# EAGLE design untitled (EAGLE 5.06)
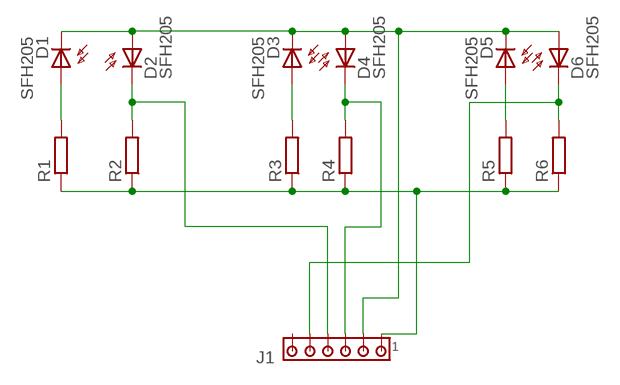
[diagram p0: schematic, sheet 1]

## Parts
D1  SFH205  [SFH205]
D2  SFH205  [SFH205]
D3  SFH205  [SFH205]
D4  SFH205  [SFH205]
D5  SFH205  [SFH205]
D6  SFH205  [SFH205]
J1  MTA06-100  [10X06MTA]
R1  R-EU_0207/10  [0207/10]
R2  R-EU_0207/10  [0207/10]
R3  R-EU_0207/10  [0207/10]
R4  R-EU_0207/10  [0207/10]
R5  R-EU_0207/10  [0207/10]
R6  R-EU_0207/10  [0207/10]

## Nets
N$1: D1.A R1.2
N$3: D3.A R3.2
N$4: D4.K(C) J1.4 R4.2
N$5: D5.A R5.2
N$6: D6.K(C) J1.2 R6.2
N$7: J1.6 R1.1 R2.1 R3.1 R4.1 R5.1 R6.1
N$8: D1.K(C) D2.A D3.K(C) D4.A D5.K(C) D6.A J1.5
N$11: D2.K(C) J1.3 R2.2
Unconnected: J1.1

## Library data of the parts
D1-D6 = opto-trans-siemens:SFH205: PHOTO DIODE
J1 = con-amp:MTA06-100: AMP connector
R1-R6 = rcl:R-EU_: RESISTOR, European symbol

## Board
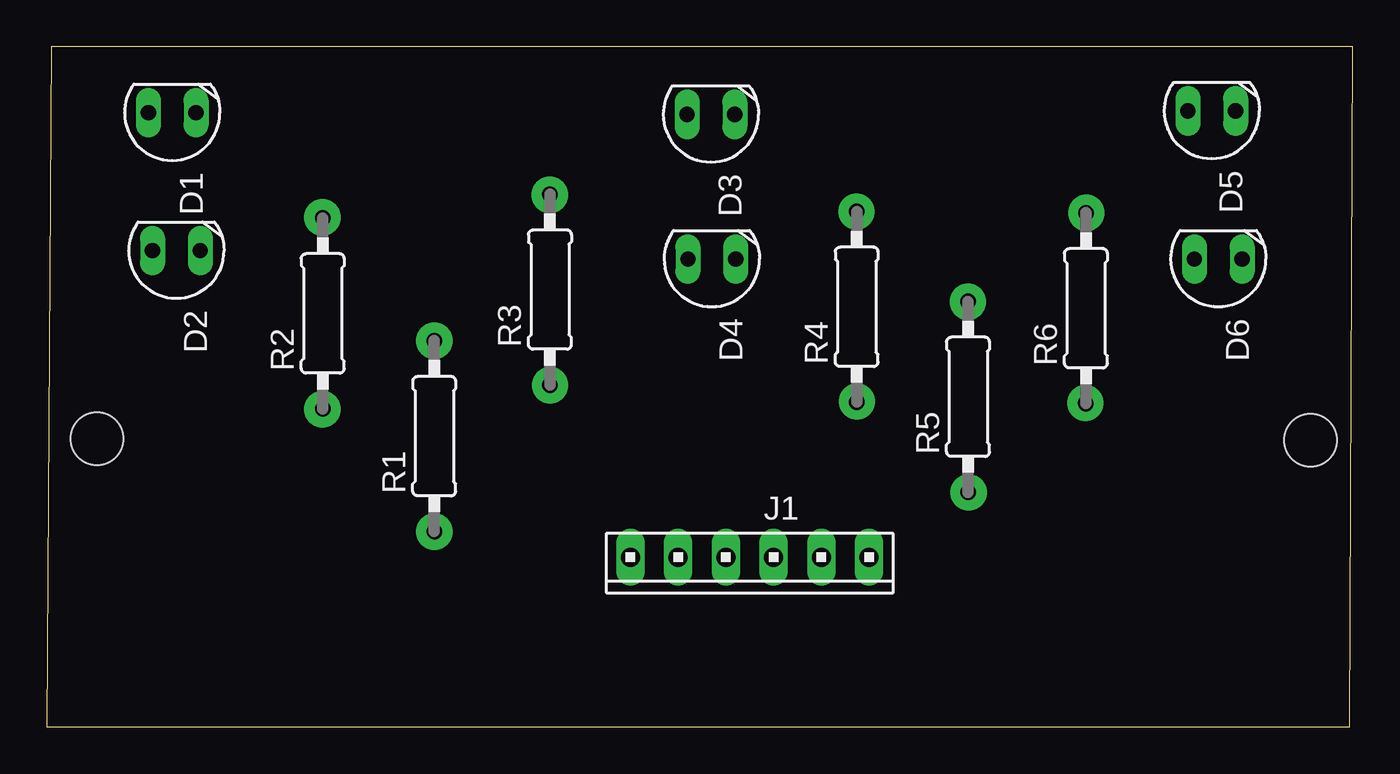
[diagram p1: board, top side]
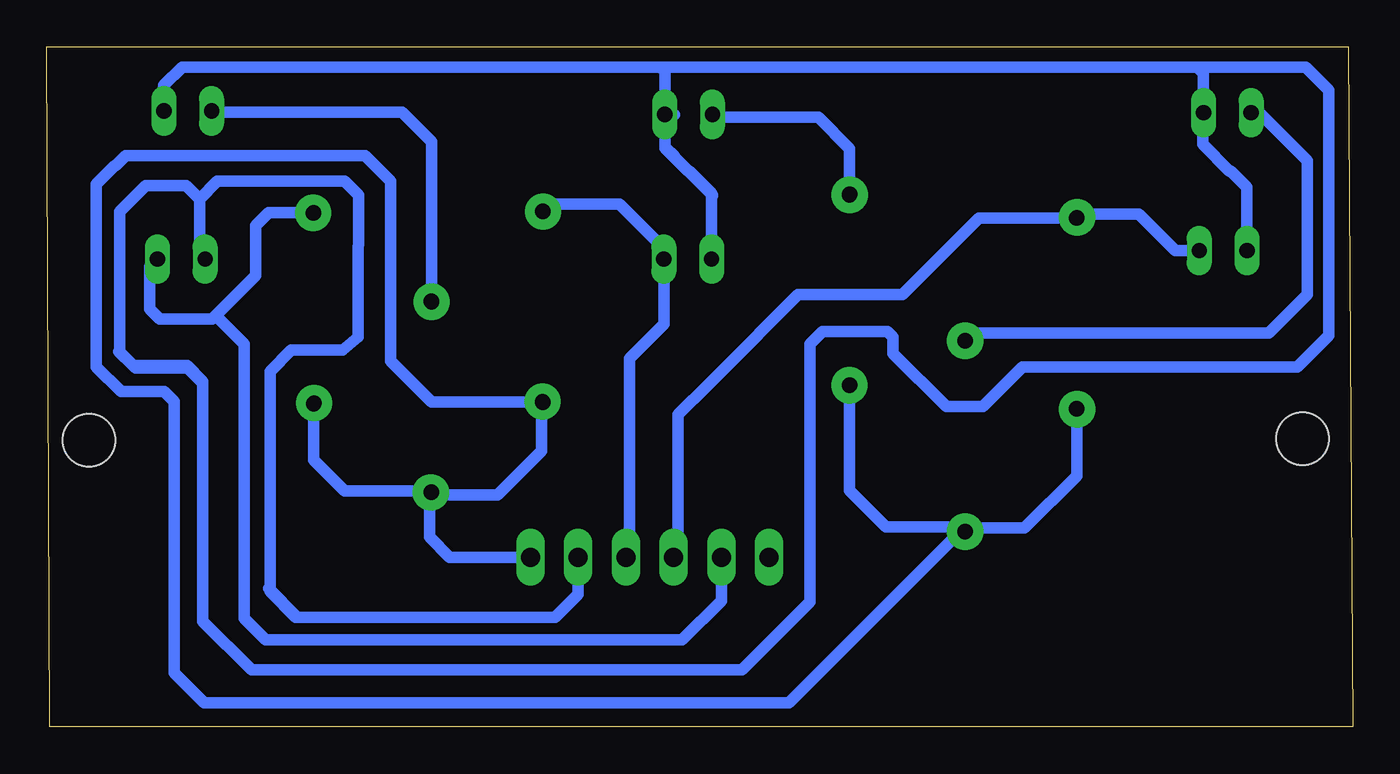
[diagram p2: board, bottom side, seen from below]

Size 69.51 x 36.2 mm. Coordinates in mm from the lower left corner, seen from the top.
Outline: 0,0 69.36,0 69.51,36.2 0.23,36.2 0,0
Copper layers (1*16): Top 0.035mm / dielectric 1.5mm / Bottom 0.035mm
Design rules "default": minimum track width 10mil, minimum drill 24mil, track to track 8mil, track to pad 8mil, pad to pad 8mil, via to via 8mil, smd to smd 8mil, copper to edge 40mil, drill to drill 8mil, minimum pad ring 10mil, minimum via ring 8mil, stop-mask expansion 4mil, vias tented up to drill 0mil, thermal gap 10mil
Holes 2.8 mm at 2.66,15.35 67.28,15.27

### Footprints (pad centres in the part's own frame; a part is rotated, then mirrored left to right if it is on the bottom)
SFH205 = drill 0.813 long: A 0,-1.27; K 0,1.27
10X06MTA = drill 1.016 long: 1 6.35,0; 2 3.81,0; 3 1.27,0; 4 -1.27,0; 5 -3.81,0; 6 -6.35,0
0207/10 = drill 0.813 octagon: 1 -5.08,0; 2 5.08,0

### Placement (x,y rotation side)
D1  6.67,32.7 270 top
D2  6.89,25.36 270 top
D3  35.35,32.61 270 top
D4  35.39,24.91 270 top
D5  62.01,32.8 270 top
D6  62.36,24.91 270 top
J1  37.41,9.03 180 top
R1  20.62,15.48 90 top
R2  14.68,22.01 90 top
R3  26.78,23.28 90 top
R4  43.11,22.37 90 top
R5  49.04,17.57 90 top
R6  55.31,22.29 90 top

### Tracks (layer width: path | path; a pad name or v marks a point on that pad's centre or on a via)
N$1
  Bottom 0.61: D1.A 4.98,32.7 2.42,30.14 2.42,23.01 4.45,20.97 20.21,20.97 R1.2
N$3
  Bottom 0.61: R3.2 26.78,30.78 28.45,32.45 33.39,32.45 D3.A
N$4
  Bottom 0.61: R4.2 42.72,27.83 39.02,27.83 36.66,25.48 D4.K 36.66,21.45 37.89,20.22 38.5,19.61 38.5,9.21 J1.4
N$5
  Bottom 0.61: R5.2 49.04,31.15 50.61,32.72 60.67,32.72 D5.A
N$6
  Bottom 0.61: R6.2 57.72,27.37 58.41,26.68 58.41,24.03 60.53,21.9 | 60.53,21.9 60.71,21.72 63.51,21.72 64.03,22.25 64.03,24.51 D6.K 63.49,24.77 | J1.2 33.6,6.71 35.69,4.62 57.86,4.62 59,5.76 59,20.37 60.53,21.9
N$7
  Bottom 0.61: R2.1 14.68,13.36 17.47,10.58 20.44,10.58 R1.1 | R3.1 26.78,12.57 24.85,10.65 20.87,10.65 R1.1 | R5.1 48.9,12.35 45.53,12.35 43.19,14.69 43.19,17.21 R4.1 49.03,17.29 51.22,19.48 51.22,29.06 52.58,30.41 65.31,30.41 65.84,29.89 65.9,29.89 66.89,28.89 66.89,19.17 65.57,17.85 63.26,17.85 62.73,17.31 62.73,2.87 61.13,1.27 30,1.27 21.16,10.11 20.33,10.11 R1.1 | R6.1 55.31,14.21 53.66,12.55 49.1,12.55 R5.1 | R5.1 49.25,12.28 | J1.6 48.06,9.03 49.13,10.1 49.13,11.85 49.06,11.93 49.06,12.47 R5.1
N$8
  Bottom 0.61: D2.A 5.62,28.73 6.48,29.6 6.55,29.6 7.98,31.03 7.98,32.66 D1.K 7.94,34.8 8.27,35.14 | 36.11,32.6 D3.K 36.59,32.59 36.59,30.88 36.11,30.39 36.11,30.35 35.36,29.6 35.29,29.6 34.12,28.43 D4.A 34.12,28.26 34.08,28.3 36.59,30.81 36.59,34.87 36.86,35.14 | 61.39,28.11 60.44,29.06 53.66,29.06 52.92,28.31 52.92,25.71 52.93,25.55 52.93,20.75 53.77,20.07 56.5,20.07 57.64,18.93 57.64,7.21 56.27,5.84 56.19,5.84 | 61.39,28.11 61.39,25.21 D6.A | D5.K 63.28,34.16 62.3,35.14 36.86,35.14 | 8.27,35.14 2.5,35.14 1.27,33.9 1.27,20.83 2.93,19.16 17.57,19.16 19.68,17.05 21.63,17.05 24.46,19.89 24.46,20.76 24.75,21.05 28.23,21.05 28.89,20.39 28.89,6.64 32.5,3.02 58.62,3.02 61.21,5.61 61.21,18.39 | 8.27,35.14 36.86,35.14 | 61.39,28.11 62.1,28.82 64.24,28.82 65.64,27.43 65.64,19.96 64.78,19.1 62.01,19.1 61.3,18.39 61.21,18.39 | J1.5 41.22,7.06 42.45,5.84 56.19,5.84 | 56.19,5.84 57.71,7.36 | 61.21,18.39 62.04,19.23 64.93,19.23 65.69,19.99
N$9  (via drill 0.8 pad 1.93)
  other vias: 14.67,27.13
N$10  (via drill 0.8 pad 1.93)
  other vias: 20.63,20.55
N$11
  Bottom 0.61: D2.K 9.43,25.36 11.37,27.29 14.48,27.29 R2.2 19.89,27.09 23.97,23.01 29.53,23.01 31.63,20.91 31.63,20.9 35.09,17.44 35.12,17.44 35.92,16.64 35.92,9.26 J1.3
N$12  (via drill 0.8 pad 1.93)
  other vias: 14.67,16.91
N$13  (via drill 0.8 pad 1.93)
  other vias: 20.63,10.39
N$14  (via drill 0.8 pad 1.93)
  other vias: 26.78,18.18
N$15  (via drill 0.8 pad 1.93)
  other vias: 26.77,28.32
N$16  (via drill 0.8 pad 1.93)
  other vias: 43.09,27.43
N$17  (via drill 0.8 pad 1.93)
  other vias: 55.34,27.36
N$18  (via drill 0.8 pad 1.93)
  other vias: 43.12,17.32
N$19  (via drill 0.8 pad 1.93)
  other vias: 49.07,12.48
N$20  (via drill 0.8 pad 1.93)
  other vias: 55.29,17.24
N$21  (via drill 0.8 pad 1.93)
  other vias: 49.03,22.63